# Altium schematic sheet PWMfilterSims.SchDoc
size A
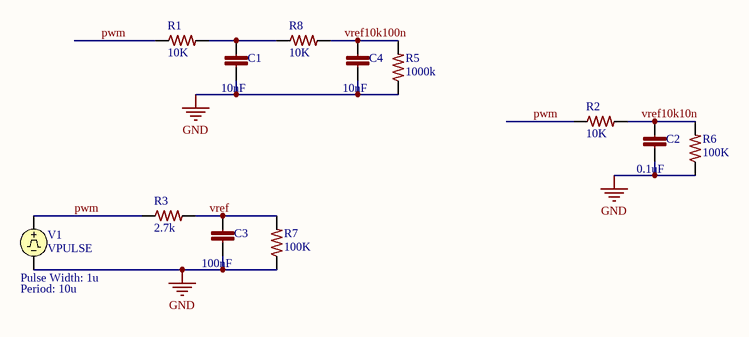
[diagram p0: PWMfilterSims.SchDoc]

## Parts
C1  10nF  [C0402]
C2  0.1uF  [C0402]
C3  100nF  [C0402]
C4  10nF  [C0402]
R1  10K  [R0603]
R2  10K  [R0603]
R3  2.7k  [R0603]
R5  1000k  [R0603]
R6  100K  [R0603]
R7  100K  [R0603]
R8  10K  [R0603]
V1  VPULSE  Pulse Width: 1u  Period: 10u

## Nets
GND: C1.2 C2.2 C3.2 C4.2 R5.1 R6.1 R7.1 V1.2
pwm: R1.1 R2.1 R3.1 V1.1
vref: C3.1 R3.2 R7.2
vref10k10n: C2.1 R2.2 R6.2
vref10k100n: C4.1 R5.2 R8.2
NetC1_1: C1.1 R1.2 R8.1

## Library data of the parts
C1-C4 = GRM155R60J105KE19D: CAP CER 0402 1uF 6.3V 10% X5R; LastRevisionNote: ImportComponents; Published: 23-Apr-2014; Publisher: UltiMachine; LastRevisionDate: 23-Apr-2014; ManufacturerPartNumber: GRM155R60J105KE19D
  C1 C4: VALUE: 10nF
  C2: VALUE: 0.1uF
  C3: VALUE: 100nF
R1-R3 R8 = ERJ-3EKF1002V: RES 0603 10K 100mW 1%; LastRevisionNote: ImportComponents; Published: 23-Apr-2014; Publisher: UltiMachine; LastRevisionDate: 23-Apr-2014; ManufacturerPartNumber: ERJ-3EKF1002V
  R1 R2 R8: VALUE: 10K
  R3: VALUE: 2.7k
R5-R7 = RC0603FR-07100KL: RES 100K OHM 1/10W 1% 0603 SMD; LastRevisionNote: ImportComponents; Published: 23-Apr-2014; Publisher: UltiMachine; LastRevisionDate: 23-Apr-2014; ManufacturerPartNumber: RC0603FR-07100KL
  R5: VALUE: 1000k
  R6 R7: VALUE: 100K
V1 = VPULSE: Pulse Voltage Source; Note: PCB Footprint - Not required; Published: 8-Jun-2000; LatestRevisionDate: 15-Nov-2004; LatestRevisionNote: Corrected Netlist.; PackageReference: Not Applicable; Publisher: Altium Limited